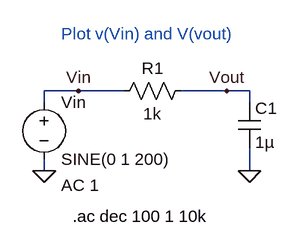
[diagram p0: schematic Fig1_23.asc]
Fig1_23.asc, the LTspice schematic file:
Version 4
SHEET 1 1048 680
WIRE 48 224 0 224
WIRE 112 224 48 224
WIRE 256 224 192 224
WIRE 288 224 256 224
WIRE 0 240 0 224
WIRE 288 240 288 224
WIRE 0 336 0 320
WIRE 288 336 288 304
FLAG 0 336 0
FLAG 288 336 0
FLAG 256 224 Vout
FLAG 48 224 Vin
SYMBOL voltage 0 224 R0
WINDOW 123 24 132 Left 0
WINDOW 39 0 0 Left 0
SYMATTR Value2 AC 1
SYMATTR InstName Vin
SYMATTR Value SINE(0 1 200)
SYMBOL res 96 240 R270
WINDOW 0 32 56 VTop 0
WINDOW 3 0 56 VBottom 0
SYMATTR InstName R1
SYMATTR Value 1k
SYMBOL cap 272 240 R0
SYMATTR InstName C1
SYMATTR Value 1µ
TEXT 40 400 Left 0 !.ac dec 100 1 10k
TEXT 24 144 Left 0 ;Plot v(Vin) and V(vout)

The netlist it stands for:
* Fig1_23.asc
Vin Vin 0 SINE(0 1 200) AC 1
R1 Vin Vout 1k
C1 Vout 0 1µ
.ac dec 100 1 10k
* Plot v(Vin) and V(vout)
.backanno
.end